# Altium schematic sheet TempProbe.SchDoc
size A; SheetNumber: 6; SheetTotal: 7
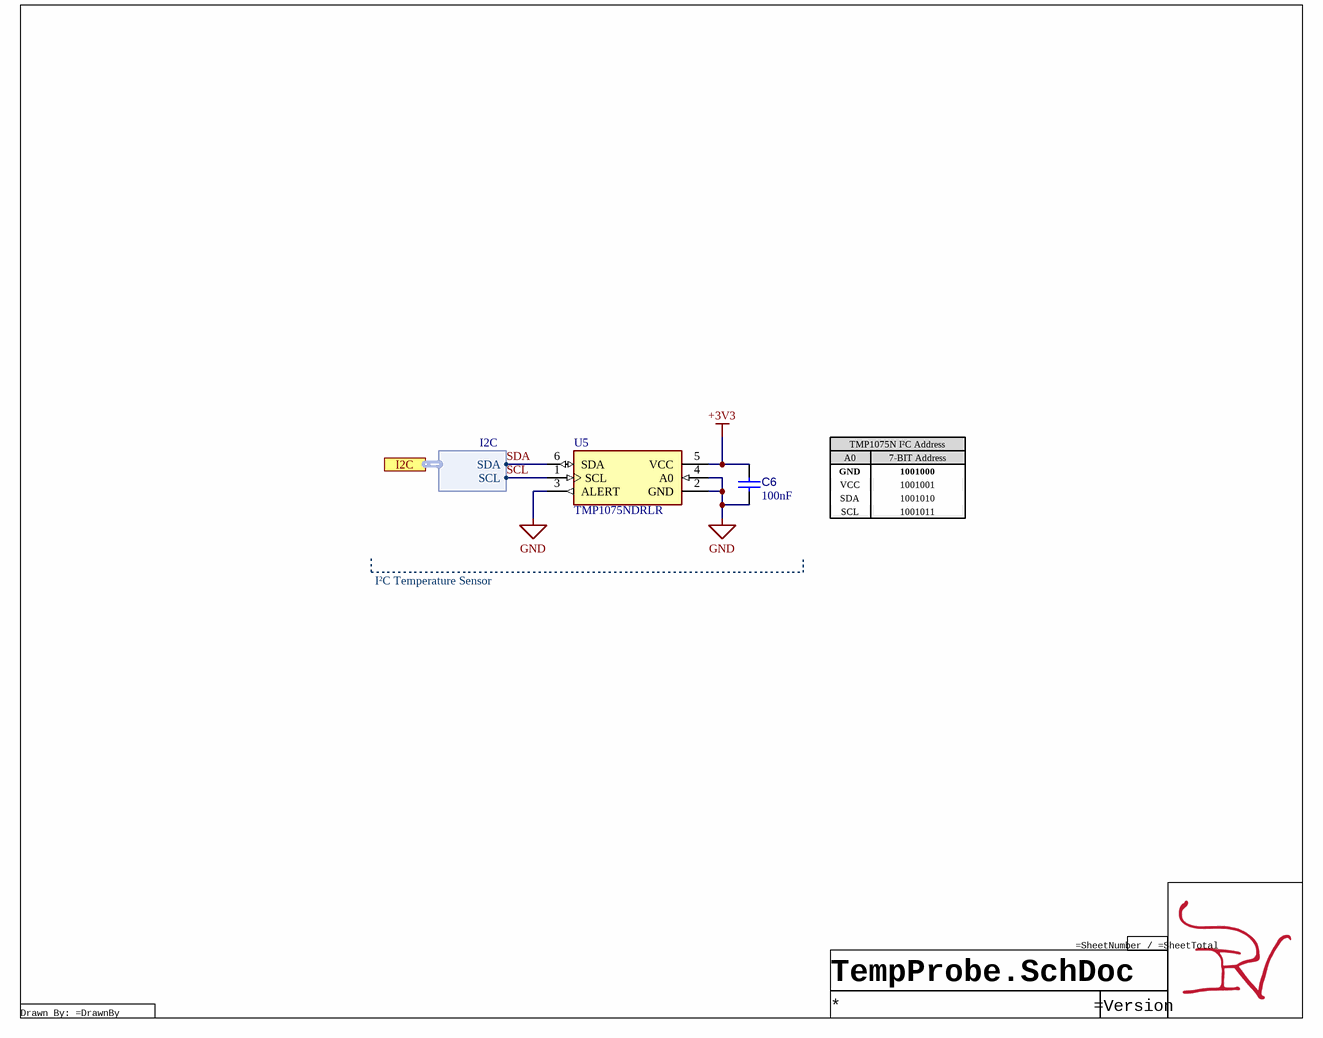
[diagram p0: TempProbe.SchDoc]

## Parts
C6  value 100nF  [CAP 0402_1005]  (hidden comment: CAP-NP-2)
U5  TMP1075NDRLR  [SOT50P160X60-6N]

## Ports
I2C (harness I2C)

## Harnesses
I2C: SDA, SCL

## Nets
+3V3: C6.2 U5.5(VCC)
GND: C6.1 U5.2(GND) U5.3(ALERT) U5.4(A0)
SCL: U5.1(SCL) ; port I2C.SCL
SDA: U5.6(SDA) ; port I2C.SDA

## Notes on the sheet
- A0
- GND
- VCC
- SDA
- TMP1075N I²C Address
- 7-BIT Address
- 1001000
- 1001001
- 1001010
- SCL
- 1001011
- I²C Temperature Sensor
- Drawn By: =DrawnBy

## Library data of the parts
C6 = CMP-00000-4: Ceramic Capacitor, Multilayer, Ceramic, 10V, 10% +Tol, 10% -Tol, X7R, 15% TC, 0.1uF, Surface Mount, 0402; Multilayer: Yes; Conflict Mineral: DRC Conflict Undeterminable; Global PFAS Assessment Status: Not Affected; Green: Compliant; NAS411: Affected; Rare Earth Element Information: Rare Earth Free; Capacitor Type: Ceramic; Case/Package: 0402; Dielectric Material: Ceramic; JESD-609 Code: e3; Max Operating Temperature: 125°C; Min Operating Temperature: -55°C; Mounting Technology: Surface Mount; Package Shape: Rectangular; Packaging: Tape and Reel; Pins: 2; Rated DC Voltage (URdc): 10V; Reach SVHC Compliant: Yes; RoHS Compliant: Yes; Temperature Characteristics Code: X7R; Terminal Finish: Nickel; Termination: Wraparound; Tolerance  (fill in as +-): 10%; Tolerance (fill in as +-): 10%; Tolerance: 10%; Voltage Rating: 10V; China RoHS Status: Unaffected; ELV: Compliant; EU SVHC List Version: Jan 23, 2024; Halogen Free: Compliant; Lead Free: Compliant; Persistent Organic Pollutants (POPs): Not Affected; REACH(SVHC) Information: Unaffected; RoHS Status: Yes; RoHS Version: 2011/65/EU, 2015/863; TSCA: Compliant; Capacitance: 100nF; Case Code (Imperial): 0402; Case Code (Metric): 1005; Construction: Flat; Contact Plating: Tin; Depth: 0.5mm; Dielectric: X7R; Height: 0.5mm; Length: 1mm; Mount: Surface Mount; Package Quantity: 1; Package Style: SMTMeter; Radiation Hardening: No; Series: CL; Thickness: 0.022inch; Width: 0.5mm
U5 = CMP-773-000000-3: Serial Switch/Digital Sensor, 12 Bit(s), 2Cel, Rectangular, 6 Pin, Surface Mount; MF: {'manufacturer': u'Texas Instruments'}; Value: *; Design Item ID: TMP1075NDRLR; MP: TMP1075NDRLR; Price: None; Package: None; Source: TMP1075NDRLR.SchLib; Availability: Unavailable; RoHS Compliant: Yes